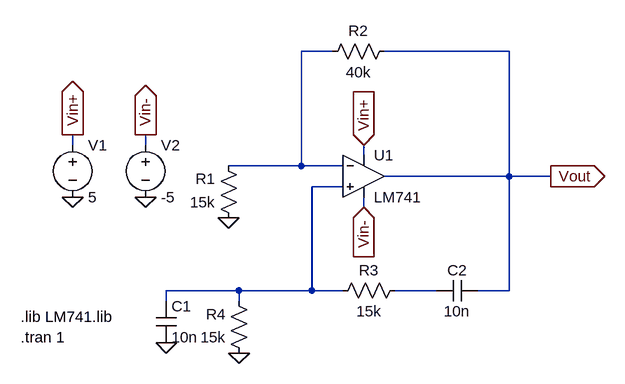
[diagram p0: schematic Draft21.asc]
Draft21.asc, the LTspice schematic file:
Version 4
SHEET 1 880 680
WIRE 368 80 320 80
WIRE 640 80 448 80
WIRE -32 224 -32 208
WIRE 80 224 80 208
WIRE 416 240 416 224
WIRE 320 256 320 80
WIRE 320 256 208 256
WIRE 384 256 320 256
WIRE 640 272 640 80
WIRE 640 272 448 272
WIRE 704 272 640 272
WIRE 384 288 336 288
WIRE 416 320 416 304
WIRE 224 448 112 448
WIRE 336 448 336 288
WIRE 336 448 224 448
WIRE 384 448 336 448
WIRE 528 448 464 448
WIRE 640 448 640 272
WIRE 640 448 592 448
WIRE 112 464 112 448
WIRE 224 464 224 448
FLAG 416 224 Vin+
IOPIN 416 224 In
FLAG 416 320 Vin-
IOPIN 416 320 In
FLAG 208 336 0
FLAG 80 304 0
FLAG -32 304 0
FLAG 112 528 0
FLAG 224 544 0
FLAG 704 272 Vout
IOPIN 704 272 Out
FLAG -32 208 Vin+
IOPIN -32 208 Out
FLAG 80 208 Vin-
IOPIN 80 208 Out
SYMBOL Opamps/opamp2 416 208 R0
SYMATTR InstName U1
SYMATTR Value LM741
SYMBOL res 224 352 R180
WINDOW 0 36 76 Left 2
WINDOW 3 36 40 Left 2
SYMATTR InstName R1
SYMATTR Value 15k
SYMBOL res 464 64 R90
WINDOW 0 0 56 VBottom 2
WINDOW 3 32 56 VTop 2
SYMATTR InstName R2
SYMATTR Value 40k
SYMBOL res 480 432 R90
WINDOW 0 0 56 VBottom 2
WINDOW 3 32 56 VTop 2
SYMATTR InstName R3
SYMATTR Value 15k
SYMBOL res 240 560 R180
WINDOW 0 36 76 Left 2
WINDOW 3 36 40 Left 2
SYMATTR InstName R4
SYMATTR Value 15k
SYMBOL cap 96 464 R0
SYMATTR InstName C1
SYMATTR Value 10n
SYMBOL cap 592 432 R90
WINDOW 0 0 32 VBottom 2
WINDOW 3 32 32 VTop 2
SYMATTR InstName C2
SYMATTR Value 10n
SYMBOL voltage -32 208 R0
SYMATTR InstName V1
SYMATTR Value 5
SYMBOL voltage 80 208 R0
SYMATTR InstName V2
SYMATTR Value -5
TEXT -112 488 Left 2 !.lib LM741.lib
TEXT -112 520 Left 2 !.tran 1

The netlist it stands for:
* Draft21.asc
XU1 N002 N001 Vin+ Vin- Vout LM741  ; pins In+ In- V+ V- OUT
R1 0 N001 15k
R2 Vout N001 40k
R3 N003 N002 15k
R4 0 N002 15k
C1 N002 0 10n
C2 Vout N003 10n
V1 Vin+ 0 5
V2 Vin- 0 -5
.lib LM741.lib
.tran 1
.backanno
.end